# EAGLE schematic Layout (EAGLE 8.5.2)
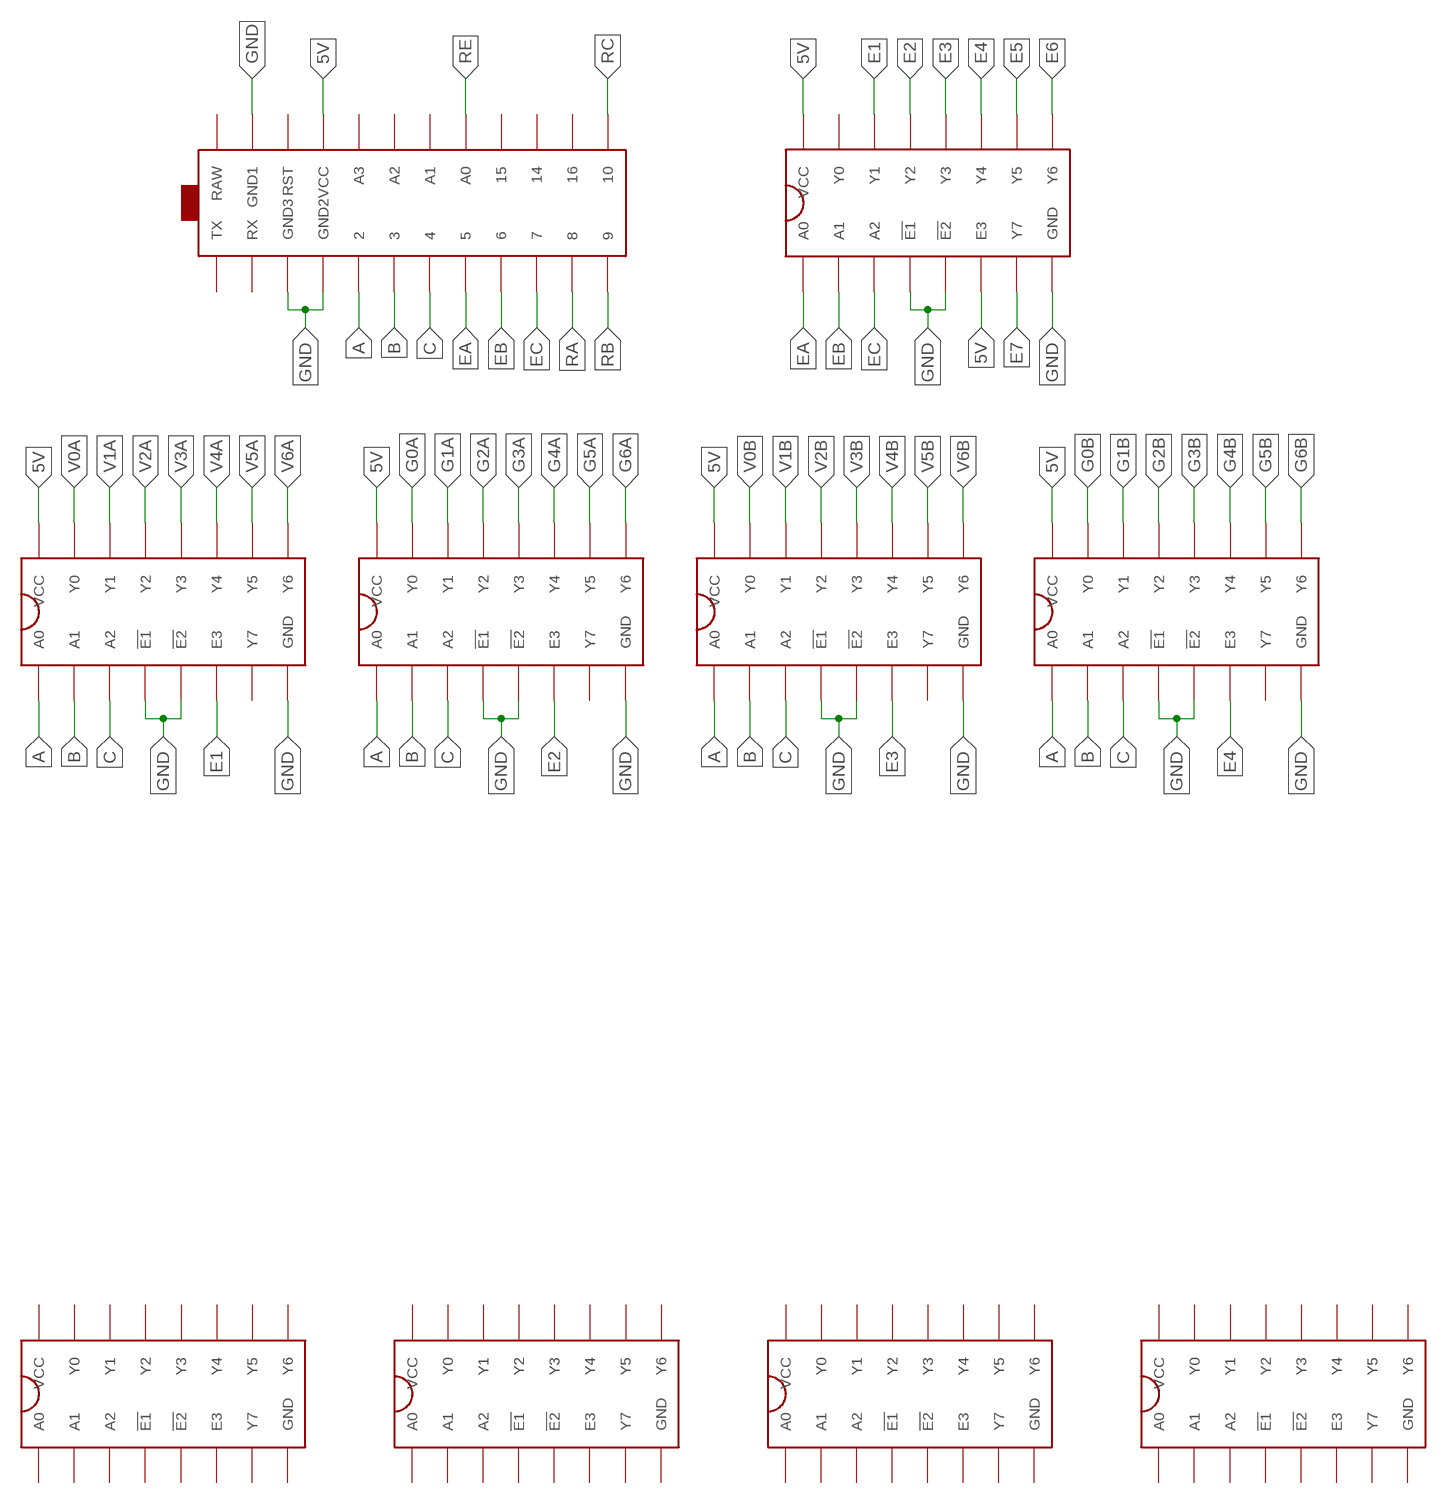
[diagram p0: schematic, sheet 1]

## Parts
U$1  MCU  [MCU]
U$2  DEMUX  [DEMUX]
U$3  DEMUX  [DEMUX]
U$4  DEMUX  [DEMUX]
U$5  DEMUX  [DEMUX]
U$6  DEMUX  [DEMUX]
U$7  DEMUX  [DEMUX]
U$8  DEMUX  [DEMUX]
U$9  DEMUX  [DEMUX]
U$10  DEMUX  [DEMUX]

## Nets
5V: U$1.P$24(VCC) U$2.P$6(E3) U$2.P$8(VCC) U$3.P$8(VCC) U$4.P$8(VCC) U$5.P$8(VCC) U$6.P$8(VCC)
A: U$1.P$1 U$3.P$3(A0) U$4.P$3(A0) U$5.P$3(A0) U$6.P$3(A0)
B: U$1.P$2 U$3.P$4(A1) U$4.P$4(A1) U$5.P$4(A1) U$6.P$4(A1)
C: U$1.P$3 U$3.P$5(A2) U$4.P$5(A2) U$5.P$5(A2) U$6.P$5(A2)
E1: U$2.P$10(Y1) U$3.P$6(E3)
E2: U$2.P$11(Y2) U$4.P$6(E3)
E3: U$2.P$12(Y3) U$5.P$6(E3)
E4: U$2.P$13(Y4) U$6.P$6(E3)
E5: U$2.P$14(Y5)
E6: U$2.P$15(Y6)
E7: U$2.P$16(Y7)
EA: U$1.P$4 U$2.P$3(A0)
EB: U$1.P$5 U$2.P$4(A1)
EC: U$1.P$6 U$2.P$5(A2)
G0A: U$4.P$9(Y0)
G0B: U$6.P$9(Y0)
G1A: U$4.P$10(Y1)
G1B: U$6.P$10(Y1)
G2A: U$4.P$11(Y2)
G2B: U$6.P$11(Y2)
G3A: U$4.P$12(Y3)
G3B: U$6.P$12(Y3)
G4A: U$4.P$13(Y4)
G4B: U$6.P$13(Y4)
G5A: U$4.P$14(Y5)
G5B: U$6.P$14(Y5)
G6A: U$4.P$15(Y6)
G6B: U$6.P$15(Y6)
GND: U$1.P$17(GND1) U$1.P$18(GND2) U$1.P$19(GND3) U$2.P$1(!E1) U$2.P$2(!E2) U$2.P$7(GND) U$3.P$1(!E1) U$3.P$2(!E2) U$3.P$7(GND) U$4.P$1(!E1) U$4.P$2(!E2) U$4.P$7(GND) U$5.P$1(!E1) U$5.P$2(!E2) U$5.P$7(GND) U$6.P$1(!E1) U$6.P$2(!E2) U$6.P$7(GND)
RA: U$1.P$7
RB: U$1.P$8
RC: U$1.P$9
RE: U$1.P$13(A0)
V0A: U$3.P$9(Y0)
V0B: U$5.P$9(Y0)
V1A: U$3.P$10(Y1)
V1B: U$5.P$10(Y1)
V2A: U$3.P$11(Y2)
V2B: U$5.P$11(Y2)
V3A: U$3.P$12(Y3)
V3B: U$5.P$12(Y3)
V4A: U$3.P$13(Y4)
V4B: U$5.P$13(Y4)
V5A: U$3.P$14(Y5)
V5B: U$5.P$14(Y5)
V6A: U$3.P$15(Y6)
V6B: U$5.P$15(Y6)
Unconnected: U$1.P$10 U$1.P$11 U$1.P$12 U$1.P$14(A1) U$1.P$15(A2) U$1.P$16(A3) U$1.P$20(RAW) U$1.P$21(RST) U$1.P$22(RX) U$1.P$23(TX) U$2.P$9(Y0) U$3.P$16(Y7) U$4.P$16(Y7) U$5.P$16(Y7) U$6.P$16(Y7) U$7.P$1(!E1) U$7.P$2(!E2) U$7.P$3(A0) U$7.P$4(A1) U$7.P$5(A2) U$7.P$6(E3) U$7.P$7(GND) U$7.P$8(VCC) U$7.P$9(Y0) U$7.P$10(Y1) U$7.P$11(Y2) U$7.P$12(Y3) U$7.P$13(Y4) U$7.P$14(Y5) U$7.P$15(Y6) U$7.P$16(Y7) U$8.P$1(!E1) U$8.P$2(!E2) U$8.P$3(A0) U$8.P$4(A1) U$8.P$5(A2) U$8.P$6(E3) U$8.P$7(GND) U$8.P$8(VCC) U$8.P$9(Y0) U$8.P$10(Y1) U$8.P$11(Y2) U$8.P$12(Y3) U$8.P$13(Y4) U$8.P$14(Y5) U$8.P$15(Y6) U$8.P$16(Y7) U$9.P$1(!E1) U$9.P$2(!E2) U$9.P$3(A0) U$9.P$4(A1) U$9.P$5(A2) U$9.P$6(E3) U$9.P$7(GND) U$9.P$8(VCC) U$9.P$9(Y0) U$9.P$10(Y1) U$9.P$11(Y2) U$9.P$12(Y3) U$9.P$13(Y4) U$9.P$14(Y5) U$9.P$15(Y6) U$9.P$16(Y7) U$10.P$1(!E1) U$10.P$2(!E2) U$10.P$3(A0) U$10.P$4(A1) U$10.P$5(A2) U$10.P$6(E3) U$10.P$7(GND) U$10.P$8(VCC) U$10.P$9(Y0) U$10.P$10(Y1) U$10.P$11(Y2) U$10.P$12(Y3) U$10.P$13(Y4) U$10.P$14(Y5) U$10.P$15(Y6) U$10.P$16(Y7)

## Library data of the parts
U$1 = Layout:MCU
U$2-U$10 = Layout:DEMUX